# EAGLE schematic flappy_perf (EAGLE 9.0.0)
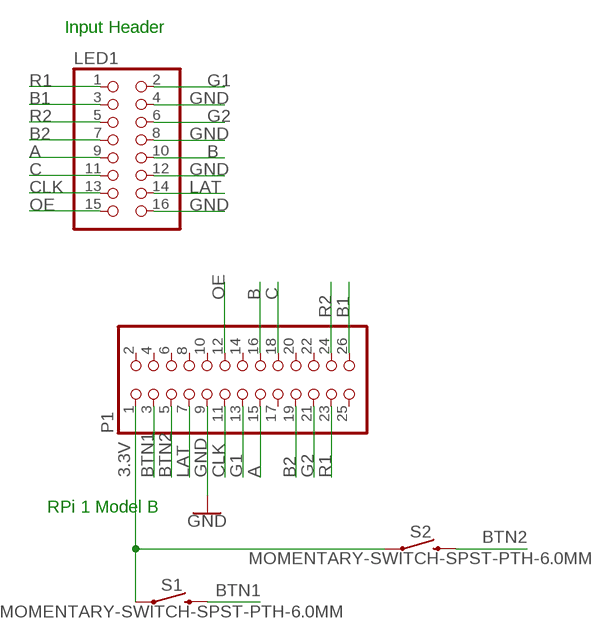
[diagram p0: schematic, sheet 1]

## Parts
LED1  PINHD-2X8  [2X08]
P1  PINHD-2X13  [2X13]
S1  MOMENTARY-SWITCH-SPST-PTH-6.0MM  [TACTILE_SWITCH_PTH_6.0MM]
S2  MOMENTARY-SWITCH-SPST-PTH-6.0MM  [TACTILE_SWITCH_PTH_6.0MM]

## Nets
3.3V: P1.1 S1.1 S2.1
A: LED1.9 P1.15
B: LED1.10 P1.16
B1: LED1.3 P1.26
B2: LED1.7 P1.19
BTN1: P1.3 S1.3
BTN2: P1.5 S2.3
C: LED1.11 P1.18
CLK: LED1.13 P1.11
G1: LED1.2 P1.13
G2: LED1.6 P1.21
GND: LED1.4 LED1.8 LED1.12 LED1.16 P1.9
LAT: LED1.14 P1.7
OE: LED1.15 P1.12
R1: LED1.1 P1.23
R2: LED1.5 P1.24
Unconnected: P1.2 P1.4 P1.6 P1.8 P1.10 P1.14 P1.17 P1.20 P1.22 P1.25

## Notes on the sheet
- Input Header
- RPi 1 Model B

## Library data of the parts
LED1 = pinhead:PINHD-2X8: PIN HEADER
P1 = pinhead:PINHD-2X13: PIN HEADER
S1 S2 = SparkFun-Switches:MOMENTARY-SWITCH-SPST: Momentary Switch (Pushbutton) - SPST Normally-open (NO) SPST momentary switches (buttons, pushbuttons). Variants PTH-12MM - 12mm square, through-hole Momentary Pushbutton Switch - 12mm Square <https://www.sparkfun.com/products/9190> (COM-09190) PTH-6.0MM, PTH-6.0MM-KIT - 6.0mm square, through-hole Mini Pushbutton Switch <https://www.sparkfun.com/products/97> (COM-00097) KIT package intended for soldering kit's - only one side of pads' copper is exposed. PTH-RIGHT-ANGLE-KIT - Right-angle, through-hole Right Angle Tactile Button <https://www.sparkfun.com/products/10791> - Used on SparkFun BigTime Watch Kit <https://www.sparkfun.com/products/11734> SMD-12MM - 12mm square, surface-mount Tactile Button - SMD (12mm) <https://www.sparkfun.com/products/12993> (COM-12993) Used on SparkFun PicoBoard <https://www.sparkfun.com/products/11888> SMD-4.5MM - 4.5mm Square Trackball Switch Used on SparkFun Blackberry Trackballer Breakout <https://www.sparkfun.com/products/13169> SMD-4.6MMX2.8MM - 4.60mm x 2.80mm, surface mount Used on SparkFun SAMD21 Mini Breakout <https://www.sparkfun.com/products/13664> SMD-5.2MM, SMD-5.2-REDUNDANT - 5.2mm square, surface-mount Mini Pushbutton Switch - SMD <https://www.sparkfun.com/products/8720> (COM-08720) Used on Arduino Pro Mini <https://www.sparkfun.com/products/11114> REDUNDANT package connects both switch circuits together SMD-6.0X3.5MM - 6.0 x 3.5mm, surface mount Momentary Reset Switch SMD <https://www.sparkfun.com/products/8229> (COM-08229) SMD-6.2MM-TALL - 6.2mm square, surface mount Tactile Button - SMD (6mm) <https://www.sparkfun.com/products/12992> Used on SparkFun Digital Sandbox <https://www.sparkfun.com/products/12651> SMD-RIGHT-ANGLE - Right-angle, surface mount Used on SparkFun Block for Intel® Edison - Arduino <https://www.sparkfun.com/products/13036>; PROD_ID: SWCH-08441; SF_SKU: COM-00097